# Altium schematic sheet InterfacesB_FPGA.SchDoc
size A; DocumentNumber: 2; SheetNumber: 2
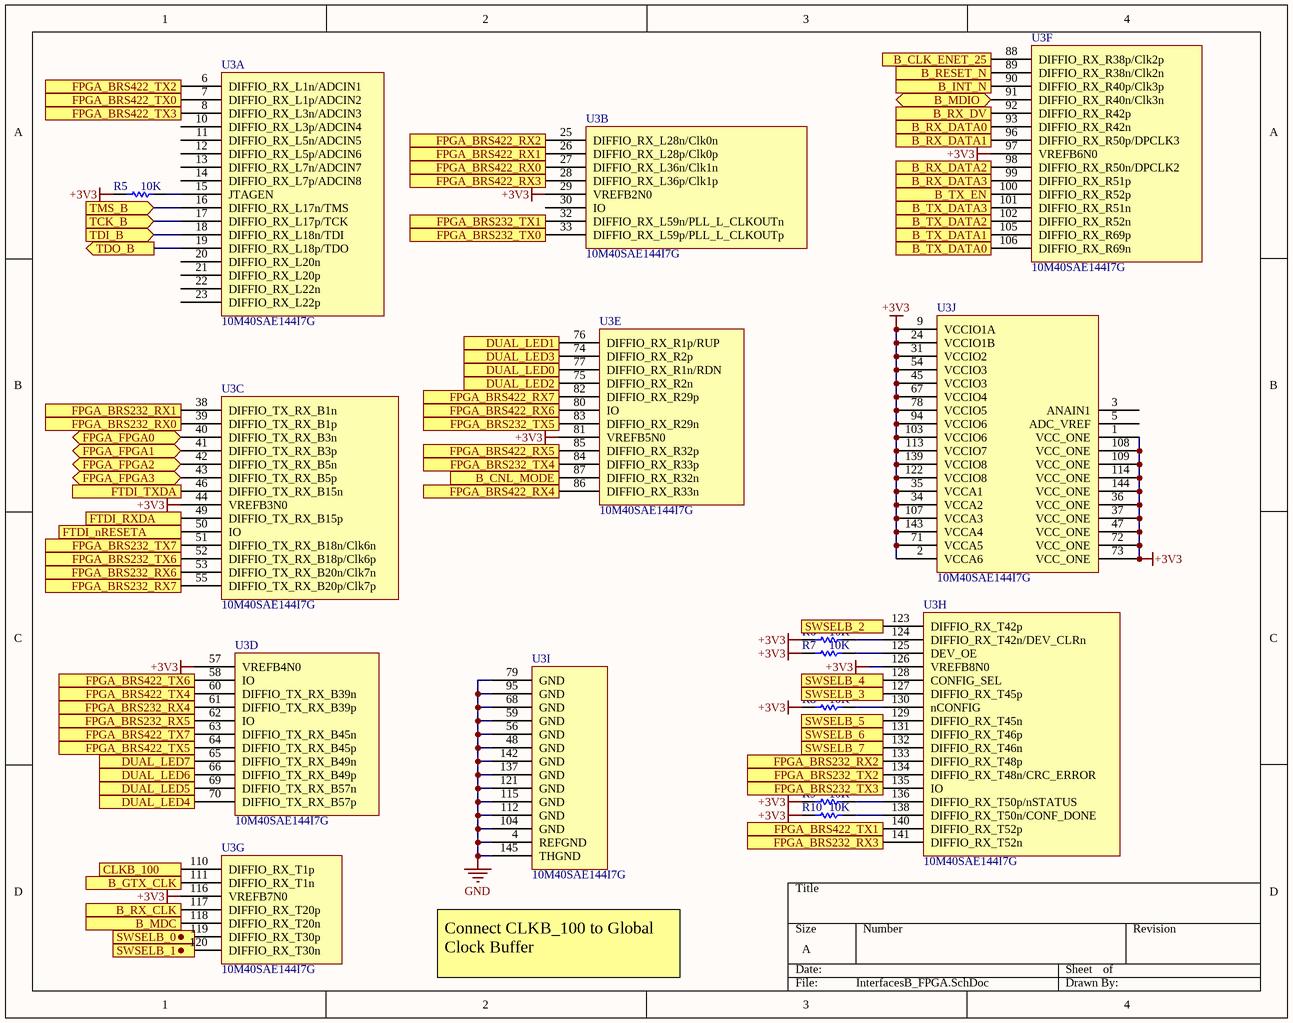
[diagram p0: InterfacesB_FPGA.SchDoc]

## Parts
R5  value 10K  [RES_0805]  (hidden comment: RES_0805)
R6  value 10K  [RES_0805]  (hidden comment: RES_0805)
R7  value 10K  [RES_0805]  (hidden comment: RES_0805)
R8  value 10K  [RES_0805]  (hidden comment: RES_0805)
R9  value 10K  [RES_0805]  (hidden comment: RES_0805)
R10  value 10K  [RES_0805]  (hidden comment: RES_0805)
U3  10M40SAE144I7G  [10M40SAE144I7G]  (parts A,B,C,D,E,F,G,H,I,J of 10)

## Ports
B_CLK_ENET_25 (out), B_CNL_MODE (in), B_GTX_CLK (out), B_INT_N (in), B_MDC (out), B_MDIO (bidir), B_RESET_N (out), B_RX_CLK (out), B_RX_DATA0 (in), B_RX_DATA1 (in), B_RX_DATA2 (in), B_RX_DATA3 (in), B_RX_DV (in), B_TX_DATA0 (out), B_TX_DATA1 (out), B_TX_DATA2 (out), B_TX_DATA3 (out), B_TX_EN (out), CLKB_100 (out), DUAL_LED0 (out), DUAL_LED1 (out), DUAL_LED2 (out), DUAL_LED3 (out), DUAL_LED4 (out), DUAL_LED5 (out), DUAL_LED6 (out), DUAL_LED7 (out), FPGA_BRS232_RX0 (in), FPGA_BRS232_RX1 (in), FPGA_BRS232_RX2 (in), FPGA_BRS232_RX3 (in), FPGA_BRS232_RX4 (in), FPGA_BRS232_RX5 (in), FPGA_BRS232_RX6 (in), FPGA_BRS232_RX7 (in), FPGA_BRS232_TX0 (out), FPGA_BRS232_TX1 (out), FPGA_BRS232_TX2 (out), FPGA_BRS232_TX3 (out), FPGA_BRS232_TX4 (out), FPGA_BRS232_TX5 (out), FPGA_BRS232_TX6 (out), FPGA_BRS232_TX7 (out), FPGA_BRS422_RX0 (in), FPGA_BRS422_RX1 (in), FPGA_BRS422_RX2 (in), FPGA_BRS422_RX3 (in), FPGA_BRS422_RX4 (in), FPGA_BRS422_RX5 (in), FPGA_BRS422_RX6 (in), FPGA_BRS422_RX7 (in), FPGA_BRS422_TX0 (out), FPGA_BRS422_TX1 (out), FPGA_BRS422_TX2 (out), FPGA_BRS422_TX3 (out), FPGA_BRS422_TX4 (out), FPGA_BRS422_TX5 (out), FPGA_BRS422_TX6 (out), FPGA_BRS422_TX7 (out), FPGA_FPGA0 (bidir), FPGA_FPGA1 (bidir), FPGA_FPGA2 (bidir), FPGA_FPGA3 (bidir), FTDI_nRESETA (out), FTDI_RXDA (in), FTDI_TXDA (out), SWSELB_0 (in), SWSELB_1 (in), SWSELB_2 (in), SWSELB_3 (in), SWSELB_4 (in), SWSELB_5 (in), SWSELB_6 (in), SWSELB_7 (in), TCK_B (in), TDI_B (in), TDO_B (out), TMS_B (in)

## Nets
+3V3: R5.2 R6.2 R7.2 R8.2 R9.2 R10.2 U3.1(VCC_ONE) U3.2(VCCA6) U3.9(VCCIO1A) U3.24(VCCIO1B) U3.29(VREFB2N0) U3.31(VCCIO2) U3.34(VCCA2) U3.35(VCCA1) U3.36(VCC_ONE) U3.37(VCC_ONE) U3.44(VREFB3N0) U3.45(VCCIO3) U3.47(VCC_ONE) U3.54(VCCIO3) U3.57(VREFB4N0) U3.67(VCCIO4) U3.71(VCCA5) U3.72(VCC_ONE) U3.73(VCC_ONE) U3.78(VCCIO5) U3.81(VREFB5N0) U3.94(VCCIO6) U3.97(VREFB6N0) U3.103(VCCIO6) U3.107(VCCA3) U3.108(VCC_ONE) U3.109(VCC_ONE) U3.113(VCCIO7) U3.114(VCC_ONE) U3.116(VREFB7N0) U3.122(VCCIO8) U3.126(VREFB8N0) U3.139(VCCIO8) U3.143(VCCA4) U3.144(VCC_ONE)
GND: U3.4(REFGND) U3.48(GND) U3.56(GND) U3.59(GND) U3.68(GND) U3.79(GND) U3.95(GND) U3.104(GND) U3.112(GND) U3.115(GND) U3.121(GND) U3.137(GND) U3.142(GND) U3.145(THGND)
B_CLK_ENET_25: U3.88(DIFFIO_RX_R38p/Clk2p) ; port B_CLK_ENET_25
B_CNL_MODE: U3.87(DIFFIO_RX_R32n) ; port B_CNL_MODE
B_GTX_CLK: U3.111(DIFFIO_RX_T1n) ; port B_GTX_CLK
B_INT_N: U3.90(DIFFIO_RX_R40p/Clk3p) ; port B_INT_N
B_MDC: U3.118(DIFFIO_RX_T20n) ; port B_MDC
B_MDIO: U3.91(DIFFIO_RX_R40n/Clk3n) ; port B_MDIO
B_RESET_N: U3.89(DIFFIO_RX_R38n/Clk2n) ; port B_RESET_N
B_RX_CLK: U3.117(DIFFIO_RX_T20p) ; port B_RX_CLK
B_RX_DATA0: U3.93(DIFFIO_RX_R42n) ; port B_RX_DATA0
B_RX_DATA1: U3.96(DIFFIO_RX_R50p/DPCLK3) ; port B_RX_DATA1
B_RX_DATA2: U3.98(DIFFIO_RX_R50n/DPCLK2) ; port B_RX_DATA2
B_RX_DATA3: U3.99(DIFFIO_RX_R51p) ; port B_RX_DATA3
B_RX_DV: U3.92(DIFFIO_RX_R42p) ; port B_RX_DV
B_TX_DATA0: U3.106(DIFFIO_RX_R69n) ; port B_TX_DATA0
B_TX_DATA1: U3.105(DIFFIO_RX_R69p) ; port B_TX_DATA1
B_TX_DATA2: U3.102(DIFFIO_RX_R52n) ; port B_TX_DATA2
B_TX_DATA3: U3.101(DIFFIO_RX_R51n) ; port B_TX_DATA3
B_TX_EN: U3.100(DIFFIO_RX_R52p) ; port B_TX_EN
CLKB_100: U3.110(DIFFIO_RX_T1p) ; port CLKB_100
DUAL_LED0: U3.77(DIFFIO_RX_R1n/RDN) ; port DUAL_LED0
DUAL_LED1: U3.76(DIFFIO_RX_R1p/RUP) ; port DUAL_LED1
DUAL_LED2: U3.75(DIFFIO_RX_R2n) ; port DUAL_LED2
DUAL_LED3: U3.74(DIFFIO_RX_R2p) ; port DUAL_LED3
DUAL_LED4: U3.70(DIFFIO_TX_RX_B57p) ; port DUAL_LED4
DUAL_LED5: U3.69(DIFFIO_TX_RX_B57n) ; port DUAL_LED5
DUAL_LED6: U3.66(DIFFIO_TX_RX_B49p) ; port DUAL_LED6
DUAL_LED7: U3.65(DIFFIO_TX_RX_B49n) ; port DUAL_LED7
FPGA_BRS232_RX0: U3.39(DIFFIO_TX_RX_B1p) ; port FPGA_BRS232_RX0
FPGA_BRS232_RX1: U3.38(DIFFIO_TX_RX_B1n) ; port FPGA_BRS232_RX1
FPGA_BRS232_RX2: U3.133(DIFFIO_RX_T48p) ; port FPGA_BRS232_RX2
FPGA_BRS232_RX3: U3.141(DIFFIO_RX_T52n) ; port FPGA_BRS232_RX3
FPGA_BRS232_RX4: U3.61(DIFFIO_TX_RX_B39p) ; port FPGA_BRS232_RX4
FPGA_BRS232_RX5: U3.62(IO) ; port FPGA_BRS232_RX5
FPGA_BRS232_RX6: U3.53(DIFFIO_TX_RX_B20n/Clk7n) ; port FPGA_BRS232_RX6
FPGA_BRS232_RX7: U3.55(DIFFIO_TX_RX_B20p/Clk7p) ; port FPGA_BRS232_RX7
FPGA_BRS232_TX0: U3.33(DIFFIO_RX_L59p/PLL_L_CLKOUTp) ; port FPGA_BRS232_TX0
FPGA_BRS232_TX1: U3.32(DIFFIO_RX_L59n/PLL_L_CLKOUTn) ; port FPGA_BRS232_TX1
FPGA_BRS232_TX2: U3.134(DIFFIO_RX_T48n/CRC_ERROR) ; port FPGA_BRS232_TX2
FPGA_BRS232_TX3: U3.135(IO) ; port FPGA_BRS232_TX3
FPGA_BRS232_TX4: U3.84(DIFFIO_RX_R33p) ; port FPGA_BRS232_TX4
FPGA_BRS232_TX5: U3.83(DIFFIO_RX_R29n) ; port FPGA_BRS232_TX5
FPGA_BRS232_TX6: U3.52(DIFFIO_TX_RX_B18p/Clk6p) ; port FPGA_BRS232_TX6
FPGA_BRS232_TX7: U3.51(DIFFIO_TX_RX_B18n/Clk6n) ; port FPGA_BRS232_TX7
FPGA_BRS422_RX0: U3.27(DIFFIO_RX_L36n/Clk1n) ; port FPGA_BRS422_RX0
FPGA_BRS422_RX1: U3.26(DIFFIO_RX_L28p/Clk0p) ; port FPGA_BRS422_RX1
FPGA_BRS422_RX2: U3.25(DIFFIO_RX_L28n/Clk0n) ; port FPGA_BRS422_RX2
FPGA_BRS422_RX3: U3.28(DIFFIO_RX_L36p/Clk1p) ; port FPGA_BRS422_RX3
FPGA_BRS422_RX4: U3.86(DIFFIO_RX_R33n) ; port FPGA_BRS422_RX4
FPGA_BRS422_RX5: U3.85(DIFFIO_RX_R32p) ; port FPGA_BRS422_RX5
FPGA_BRS422_RX6: U3.80(IO) ; port FPGA_BRS422_RX6
FPGA_BRS422_RX7: U3.82(DIFFIO_RX_R29p) ; port FPGA_BRS422_RX7
FPGA_BRS422_TX0: U3.7(DIFFIO_RX_L1p/ADCIN2) ; port FPGA_BRS422_TX0
FPGA_BRS422_TX1: U3.140(DIFFIO_RX_T52p) ; port FPGA_BRS422_TX1
FPGA_BRS422_TX2: U3.6(DIFFIO_RX_L1n/ADCIN1) ; port FPGA_BRS422_TX2
FPGA_BRS422_TX3: U3.8(DIFFIO_RX_L3n/ADCIN3) ; port FPGA_BRS422_TX3
FPGA_BRS422_TX4: U3.60(DIFFIO_TX_RX_B39n) ; port FPGA_BRS422_TX4
FPGA_BRS422_TX5: U3.64(DIFFIO_TX_RX_B45p) ; port FPGA_BRS422_TX5
FPGA_BRS422_TX6: U3.58(IO) ; port FPGA_BRS422_TX6
FPGA_BRS422_TX7: U3.63(DIFFIO_TX_RX_B45n) ; port FPGA_BRS422_TX7
FPGA_FPGA0: U3.40(DIFFIO_TX_RX_B3n) ; port FPGA_FPGA0
FPGA_FPGA1: U3.41(DIFFIO_TX_RX_B3p) ; port FPGA_FPGA1
FPGA_FPGA2: U3.42(DIFFIO_TX_RX_B5n) ; port FPGA_FPGA2
FPGA_FPGA3: U3.43(DIFFIO_TX_RX_B5p) ; port FPGA_FPGA3
FTDI_nRESETA: U3.50(IO) ; port FTDI_nRESETA
FTDI_RXDA: U3.49(DIFFIO_TX_RX_B15p) ; port FTDI_RXDA
FTDI_TXDA: U3.46(DIFFIO_TX_RX_B15n) ; port FTDI_TXDA
SWSELB_2: U3.123(DIFFIO_RX_T42p) ; port SWSELB_2
SWSELB_3: U3.127(DIFFIO_RX_T45p) ; port SWSELB_3
SWSELB_4: U3.128(CONFIG_SEL) ; port SWSELB_4
SWSELB_5: U3.129(DIFFIO_RX_T45n) ; port SWSELB_5
SWSELB_6: U3.131(DIFFIO_RX_T46p) ; port SWSELB_6
SWSELB_7: U3.132(DIFFIO_RX_T46n) ; port SWSELB_7
TCK_B: U3.17(DIFFIO_RX_L17p/TCK) ; port TCK_B
TDI_B: U3.18(DIFFIO_RX_L18n/TDI) ; port TDI_B
TDO_B: U3.19(DIFFIO_RX_L18p/TDO) ; port TDO_B
TMS_B: U3.16(DIFFIO_RX_L17n/TMS) ; port TMS_B
NetR5_1: R5.1 U3.15(JTAGEN)
NetR6_1: R6.1 U3.124(DIFFIO_RX_T42n/DEV_CLRn)
NetR7_1: R7.1 U3.125(DEV_OE)
NetR8_1: R8.1 U3.130(nCONFIG)
NetR9_1: R9.1 U3.136(DIFFIO_RX_T50p/nSTATUS)
NetR10_1: R10.1 U3.138(DIFFIO_RX_T50n/CONF_DONE)

Not connected (* = marked no-connect by the designer): U3 3(ANAIN1) 5(ADC_VREF) 10(DIFFIO_RX_L3p/ADCIN4) 11(DIFFIO_RX_L5n/ADCIN5) 12(DIFFIO_RX_L5p/ADCIN6) 13(DIFFIO_RX_L7n/ADCIN7) 14(DIFFIO_RX_L7p/ADCIN8) 20(DIFFIO_RX_L20n) 21(DIFFIO_RX_L20p) 22(DIFFIO_RX_L22n) 23(DIFFIO_RX_L22p) 30(IO) 119(DIFFIO_RX_T30p) 120(DIFFIO_RX_T30n)

## Notes on the sheet
- Connect CLKB_100 to Global Clock Buffer

## Library data of the parts
U3 = 10M40SAE144I7G: IC FPGA 101 I/O 144EQFP